# EAGLE design zeta2rework_lw_v23_fixes (EAGLE 9.0.1)
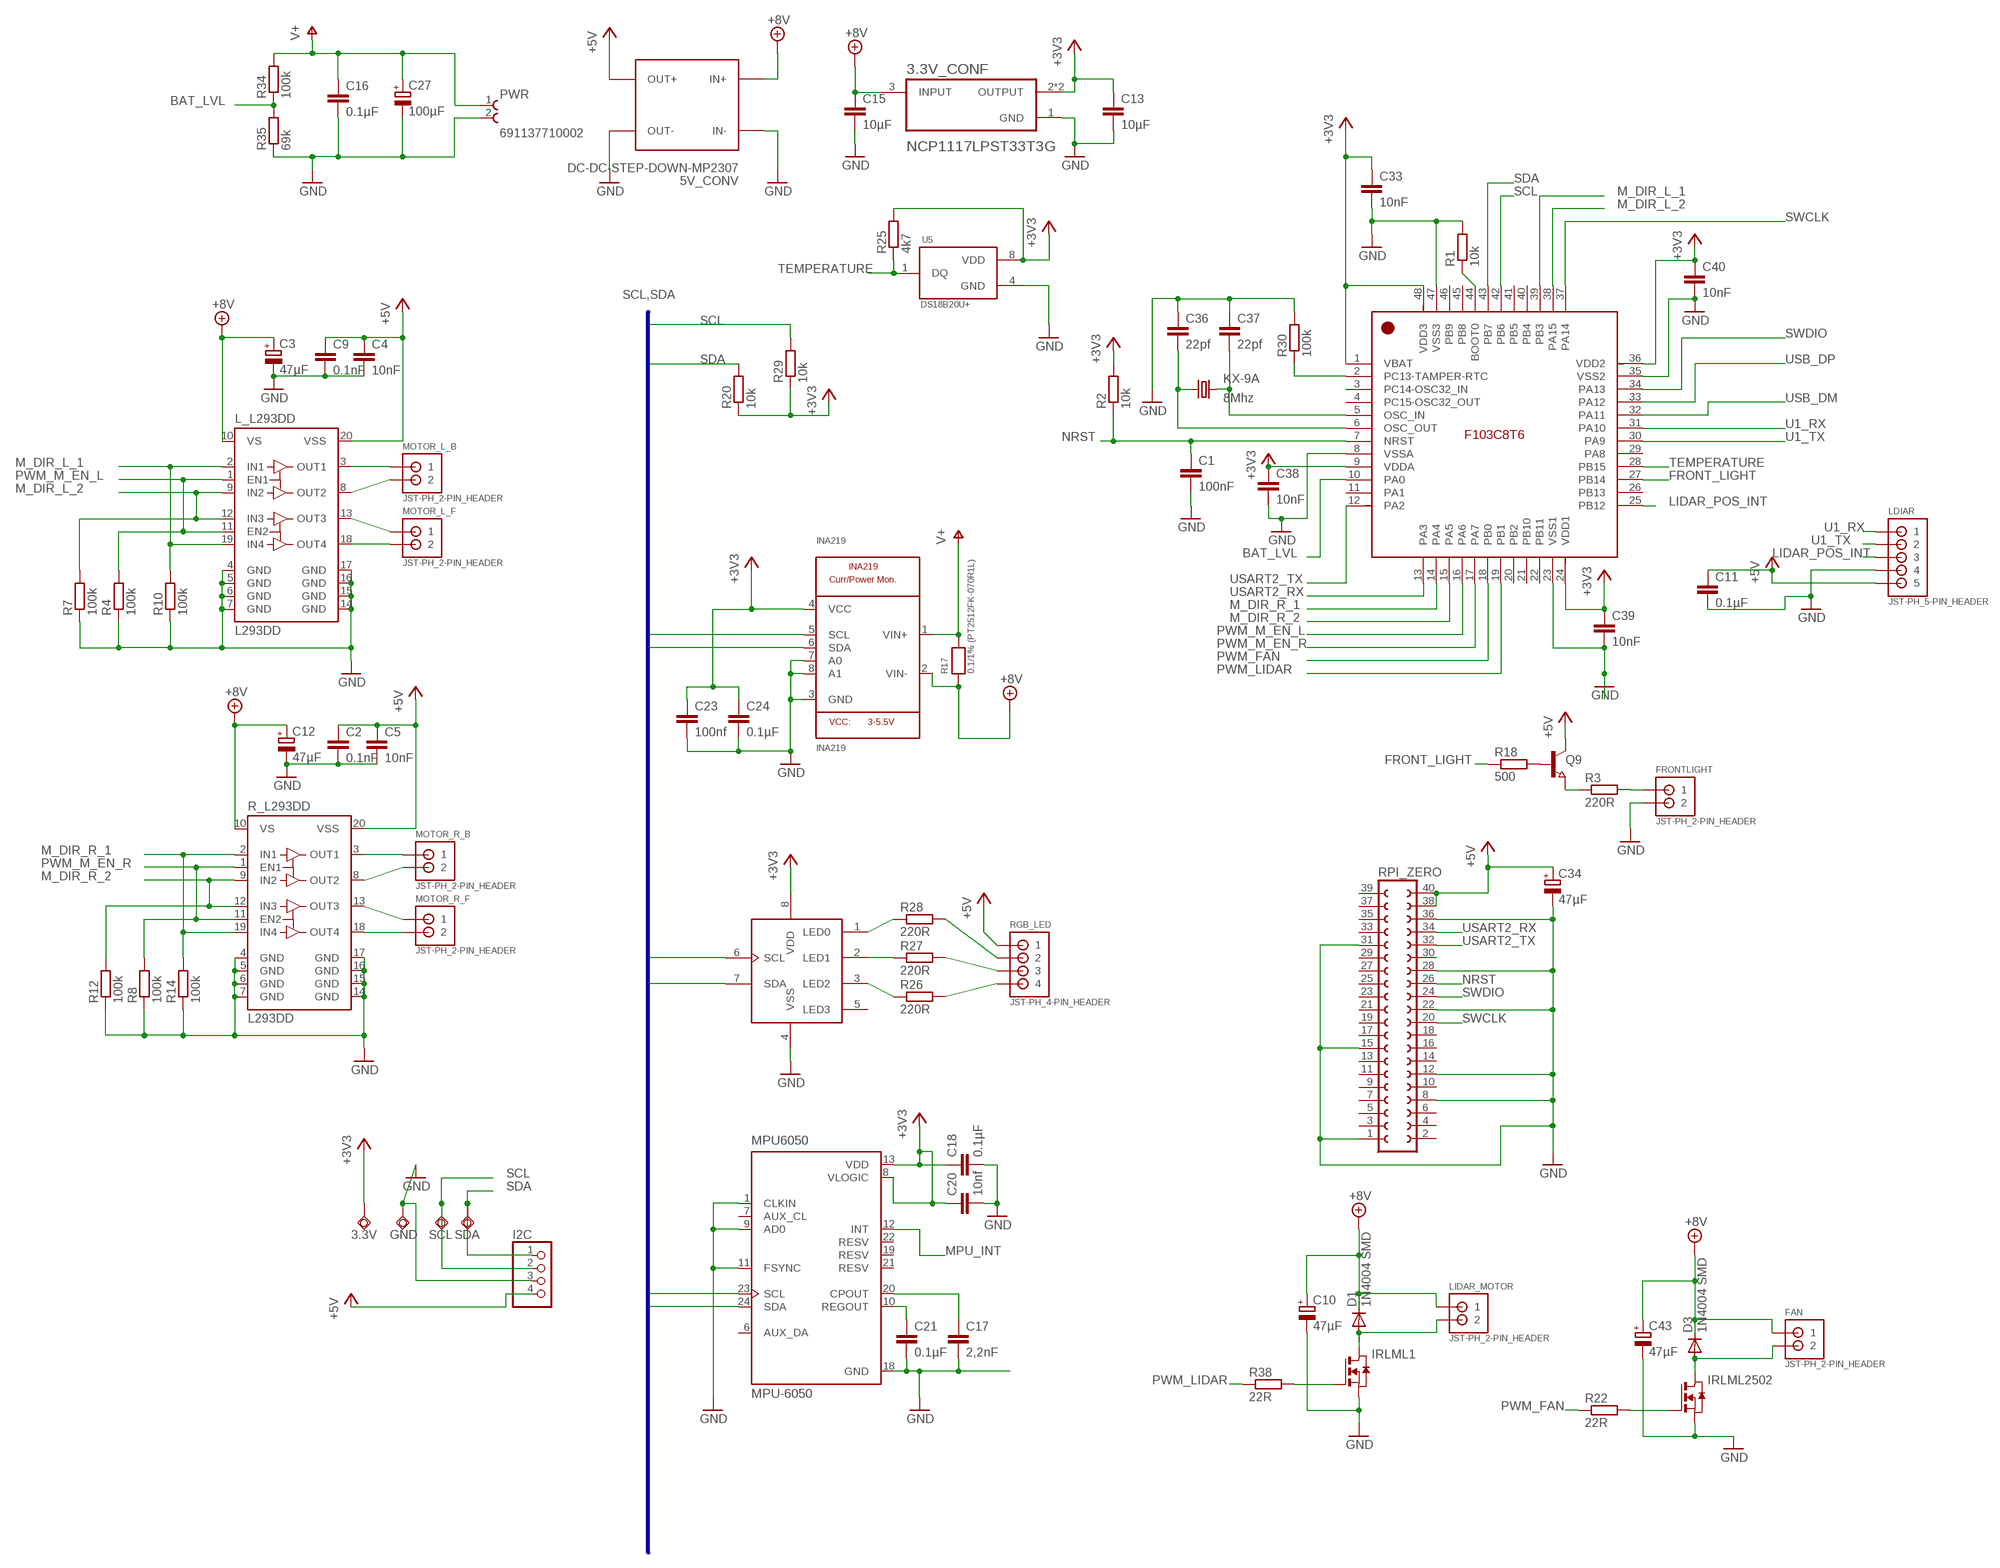
[diagram p0: schematic, sheet 1]

## Parts
3.3V  TPSQTP20R  [TP20R]
3.3V_CONF  NCP1117LPST33T3G  [SOT230P700X175-4N]
5V_CONV  DC-DC-STEP-DOWN-MP2307  [DC-DC-STEP-DOWN-MP2307]
C1  100nF  C-EUC1206  [C1206]
C2  0.1nF  C-EUC1206  [C1206]
C3  47µF  CPOL-EUUD-4X5,8  [UD-4X5,8_NICHICON]
C4  10nF  C-EUC1206  [C1206]
C5  10nF  C-EUC1206  [C1206]
C9  0.1nF  C-EUC1206  [C1206]
C10  47µF  CPOL-EUUD-4X5,8  [UD-4X5,8_NICHICON]
C11  0.1µF  C-EUC1206  [C1206]
C12  47µF  CPOL-EUUD-4X5,8  [UD-4X5,8_NICHICON]
C13  10µF  C-EUC1206  [C1206]
C15  10µF  C-EUC1206  [C1206]
C16  0.1µF  C-EUC1206  [C1206]
C17  2,2nF  C-EUC1206  [C1206]
C18  0.1µF  C-EUC1206  [C1206]
C20  10nf  C-EUC1206  [C1206]
C21  0.1µF  C-EUC1206  [C1206]
C23  100nf  C-EUC1206  [C1206]
C24  0.1µF  C-EUC1206  [C1206]
C27  100µF  CPOL-EUUD-4X5,8  [UD-4X5,8_NICHICON]
C33  10nF  C-EUC1206  [C1206]
C34  47µF  CPOL-EUUD-4X5,8  [UD-4X5,8_NICHICON]
C36  22pf  C-EUC1206  [C1206]
C37  22pf  C-EUC1206  [C1206]
C38  10nF  C-EUC1206  [C1206]
C39  10nF  C-EUC1206  [C1206]
C40  10nF  C-EUC1206  [C1206]
C43  47µF  CPOL-EUUD-4X5,8  [UD-4X5,8_NICHICON]
D1  1N4004 SMD  DIODE-DO214AC  [DO214AC]
D3  1N4004 SMD  DIODE-DO214AC  [DO214AC]
FAN  JST-PH_2-PIN_HEADER  [JST_B2B-PH_HEADER]
FRONTLIGHT  JST-PH_2-PIN_HEADER  [JST_B2B-PH_HEADER]
GND  TPSQTP20R  [TP20R]
I2C  PINHD-1X4  [1X04]
INA219  INA219  [SOT23-8]
IRLML1  NMOSSOT23  [SOT-23]
IRLML2502  NMOSSOT23  [SOT-23]
KX-9A  8Mhz  KX-9A  [5.0X3.2_KX-9A]
L_L293DD  L293DD  [SO20]
LDIAR  JST-PH_5-PIN_HEADER  [JST_B5B-PH_HEADER]
LIDAR_MOTOR  JST-PH_2-PIN_HEADER  [JST_B2B-PH_HEADER]
MOTOR_L_B  JST-PH_2-PIN_HEADER  [JST_B2B-PH_HEADER]
MOTOR_L_F  JST-PH_2-PIN_HEADER  [JST_B2B-PH_HEADER]
MOTOR_R_B  JST-PH_2-PIN_HEADER  [JST_B2B-PH_HEADER]
MOTOR_R_F  JST-PH_2-PIN_HEADER  [JST_B2B-PH_HEADER]
MPU6050  MPU-6050  [QFN50P400X400X95-24N]
PCA9533  PCA9533  [SOIC8]
PWR  691137710002  [691137710002]
Q9  NPN-TRANSISTOR_SOT23  [SOT23]
R1  10k  R-EU_R0603  [R0603]
R2  10k  R-EU_R0603  [R0603]
R3  220R  R-EU_R0603  [R0603]
R4  100k  R-EU_R0603  [R0603]
R7  100k  R-EU_R0603  [R0603]
R8  100k  R-EU_R0603  [R0603]
R10  100k  R-EU_R0603  [R0603]
R12  100k  R-EU_R0603  [R0603]
R14  100k  R-EU_R0603  [R0603]
R17  0.1/1% (PT2512FK-070R1L)  RESISTOR2512  [2512]
R18  500  R-EU_R0603  [R0603]
R20  10k  R-EU_R0603  [R0603]
R22  22R  R-EU_R0603  [R0603]
R25  4k7  R-EU_R0603  [R0603]
R26  220R  R-EU_R0603  [R0603]
R27  220R  R-EU_R0603  [R0603]
R28  220R  R-EU_R0603  [R0603]
R29  10k  R-EU_R0603  [R0603]
R30  100k  R-EU_R0603  [R0603]
R34  100k  R-EU_R0603  [R0603]
R35  69k  R-EU_R0603  [R0603]
R38  22R  R-EU_R0603  [R0603]
R_L293DD  L293DD  [SO20]
RGB_LED  JST-PH_4-PIN_HEADER  [JST_B4B-PH_HEADER]
RPI_ZERO  FE20-2  [FE20-2]
SCL  TPSQTP20R  [TP20R]
SDA  TPSQTP20R  [TP20R]
STM32F103CB  STM32F103CB  STM32F103C8T6  [LQFP48_7X7MM_0.5MMPP]
U5  DS18B20U+  [SOP65P490X95-8N]

## Nets
+3V3: 3.3V.TP 3.3V_CONF.2(OUTPUT) 3.3V_CONF.4(OUTPUT) C13.1 C18.1 C20.1 C23.1 C24.1 C33.1 C38.1 C39.1 C40.1 INA219.4(VCC) MPU6050.8(VLOGIC) MPU6050.13(VDD) PCA9533.8(VDD) R2.2 R20.1 R25.2 R29.1 STM32F103CB.1(VBAT) STM32F103CB.9(VDDA) STM32F103CB.24(VDD1) STM32F103CB.36(VDD2) STM32F103CB.48(VDD3) U5.8(VDD)
+5V: 5V_CONV.OUT+ C2.1 C4.1 C5.1 C9.1 C11.1 C34.+ I2C.4 L_L293DD.20(VSS) LDIAR.P5 Q9.3(C) R_L293DD.20(VSS) RGB_LED.P1 RPI_ZERO.38 RPI_ZERO.40
+8V: 3.3V_CONF.3(INPUT) 5V_CONV.IN+ C3.+ C10.+ C12.+ C15.1 C43.+ D1.C D3.C FAN.P1 INA219.2(VIN-) L_L293DD.10(VS) LIDAR_MOTOR.P1 R17.1 R_L293DD.10(VS)
BAT_LVL: R34.1 R35.2 STM32F103CB.10(PA0)
FRONT_LIGHT: R18.1 STM32F103CB.27(PB14)
GND: 3.3V_CONF.1(GND) 5V_CONV.IN- 5V_CONV.OUT- C1.2 C2.2 C3.- C4.2 C5.2 C9.2 C10.- C11.2 C12.- C13.2 C15.2 C16.2 C17.2 C18.2 C20.2 C21.2 C23.2 C24.2 C27.- C33.2 C34.- C36.1 C37.1 C38.2 C39.2 C40.2 C43.- FRONTLIGHT.P2 GND.TP I2C.3 INA219.3(GND) INA219.7(A0) INA219.8(A1) IRLML1.2(S) IRLML2502.2(S) L_L293DD.4(GND) L_L293DD.5(GND) L_L293DD.6(GND) L_L293DD.7(GND) L_L293DD.14(GND) L_L293DD.15(GND) L_L293DD.16(GND) L_L293DD.17(GND) LDIAR.P4 MPU6050.1(CLKIN) MPU6050.9(AD0) MPU6050.11(FSYNC) MPU6050.18(GND) PCA9533.4(VSS) PWR.2 R1.2 R4.1 R7.1 R8.1 R10.1 R12.1 R14.1 R30.2 R35.1 R_L293DD.4(GND) R_L293DD.5(GND) R_L293DD.6(GND) R_L293DD.7(GND) R_L293DD.14(GND) R_L293DD.15(GND) R_L293DD.16(GND) R_L293DD.17(GND) RPI_ZERO.1 RPI_ZERO.8 RPI_ZERO.12 RPI_ZERO.15 RPI_ZERO.22 RPI_ZERO.28 RPI_ZERO.31 RPI_ZERO.36 STM32F103CB.8(VSSA) STM32F103CB.23(VSS1) STM32F103CB.35(VSS2) STM32F103CB.47(VSS3) U5.4(GND)
LIDAR_POS_INT: LDIAR.P3 STM32F103CB.25(PB12)
M_DIR_L_1: L_L293DD.2(IN1) L_L293DD.19(IN4) R10.2 STM32F103CB.39(PB3)
M_DIR_L_2: L_L293DD.9(IN2) L_L293DD.12(IN3) R7.2 STM32F103CB.38(PA15)
M_DIR_R_1: R14.2 R_L293DD.2(IN1) R_L293DD.19(IN4) STM32F103CB.14(PA4)
M_DIR_R_2: R12.2 R_L293DD.9(IN2) R_L293DD.12(IN3) STM32F103CB.15(PA5)
MPU_INT: MPU6050.12(INT)
N$1: MOTOR_R_B.P2 R_L293DD.8(OUT2)
N$2: MOTOR_R_F.P2 R_L293DD.18(OUT4)
N$3: MOTOR_R_F.P1 R_L293DD.13(OUT3)
N$4: L_L293DD.18(OUT4) MOTOR_L_F.P2
N$5: R1.1 STM32F103CB.44(BOOT0)
N$16: L_L293DD.13(OUT3) MOTOR_L_F.P1
N$17: L_L293DD.8(OUT2) MOTOR_L_B.P2
N$18: L_L293DD.3(OUT1) MOTOR_L_B.P1
N$19: Q9.1(B) R18.2
N$20: Q9.2(E) R3.1
N$21: FRONTLIGHT.P1 R3.2
N$22: PCA9533.3(LED2) R26.1
N$23: PCA9533.2(LED1) R27.1
N$24: PCA9533.1(LED0) R28.1
N$26: MOTOR_R_B.P1 R_L293DD.3(OUT1)
N$31: R26.2 RGB_LED.P4
N$33: R27.2 RGB_LED.P3
N$34: C17.1 MPU6050.20(CPOUT)
N$35: R28.2 RGB_LED.P2
N$36: C21.1 MPU6050.10(REGOUT)
N$37: IRLML2502.3(G) R22.2
N$38: IRLML1.3(G) R38.2
N$39: D1.A IRLML1.1(D) LIDAR_MOTOR.P2
N$46: C36.2 KX-9A.1 STM32F103CB.6(OSC_OUT)
N$47: C37.2 KX-9A.3 STM32F103CB.5(OSC_IN)
N$49: R30.1 STM32F103CB.2(PC13-TAMPER-RTC)
N$55: D3.A FAN.P2 IRLML2502.1(D)
NRST: C1.1 R2.1 RPI_ZERO.26 STM32F103CB.7(NRST)
PWM_FAN: R22.1 STM32F103CB.18(PB0)
PWM_LIDAR: R38.1 STM32F103CB.19(PB1)
PWM_M_EN_L: L_L293DD.1(EN1) L_L293DD.11(EN2) R4.2 STM32F103CB.16(PA6)
PWM_M_EN_R: R8.2 R_L293DD.1(EN1) R_L293DD.11(EN2) STM32F103CB.17(PA7)
SCL: I2C.2 INA219.5(SCL) MPU6050.23(SCL) PCA9533.6(SCL) R29.2 SCL.TP STM32F103CB.42(PB6)
SDA: I2C.1 INA219.6(SDA) MPU6050.24(SDA) PCA9533.7(SDA) R20.2 SDA.TP STM32F103CB.43(PB7)
SWCLK: RPI_ZERO.20 STM32F103CB.37(PA14)
SWDIO: RPI_ZERO.24 STM32F103CB.34(PA13)
TEMPERATURE: R25.1 STM32F103CB.28(PB15) U5.1(DQ)
U1_RX: LDIAR.P1 STM32F103CB.31(PA10)
U1_TX: LDIAR.P2 STM32F103CB.30(PA9)
USART2_RX: RPI_ZERO.34 STM32F103CB.13(PA3)
USART2_TX: RPI_ZERO.32 STM32F103CB.12(PA2)
USB_DM: STM32F103CB.32(PA11)
USB_DP: STM32F103CB.33(PA12)
V+: C16.1 C27.+ INA219.1(VIN+) PWR.1 R17.2 R34.2
Unconnected: MPU6050.6(AUX_DA) MPU6050.7(AUX_CL) MPU6050.19(RESV) MPU6050.21(RESV) MPU6050.22(RESV) PCA9533.5(LED3) RPI_ZERO.2 RPI_ZERO.3 RPI_ZERO.4 RPI_ZERO.5 RPI_ZERO.6 RPI_ZERO.7 RPI_ZERO.9 RPI_ZERO.10 RPI_ZERO.11 RPI_ZERO.13 RPI_ZERO.14 RPI_ZERO.16 RPI_ZERO.17 RPI_ZERO.18 RPI_ZERO.19 RPI_ZERO.21 RPI_ZERO.23 RPI_ZERO.25 RPI_ZERO.27 RPI_ZERO.29 RPI_ZERO.30 RPI_ZERO.33 RPI_ZERO.35 RPI_ZERO.37 RPI_ZERO.39 STM32F103CB.3(PC14-OSC32_IN) STM32F103CB.4(PC15-OSC32_OUT) STM32F103CB.11(PA1) STM32F103CB.20(PB2) STM32F103CB.21(PB10) STM32F103CB.22(PB11) STM32F103CB.26(PB13) STM32F103CB.29(PA8) STM32F103CB.40(PB4) STM32F103CB.41(PB5) STM32F103CB.45(PB8) STM32F103CB.46(PB9)

## Buses
SCL,SDA

## Library data of the parts
3.3V GND SCL SDA = testpad:TPSQ: Test pad
3.3V_CONF = NCP1117LPST33T3G:NCP1117LPST33T3G: None; AVAILABILITY: Unavailable; DESCRIPTION: Linear Voltage Regulator, Positive, LDO, 1.0 A _Fixed and Adjustable_ Vout: 3.3 V; MF: ON Semiconductor; MP: NCP1117LPST33T3G; PACKAGE: SOT-223 ON Semiconductor; PRICE: None
5V_CONV = diy-modules:DC-DC-STEP-DOWN-MP2307: DC/DC Step-Down Regulator based on MP2307DN chip MP2307 datasheet available here: https://cdn-shop.adafruit.com/datasheets/MP2307_r1.9.pdf Click here to find device on ebay.com <http://www.ebay.com/sch/dc+dc+3a+mini+converter>
C1 C2 C4 C5 C9 C11 C13 C15-C18 C20 C21 C23 C24 C33 C36-C40 = rcl:C-EU: CAPACITOR, European symbol; SPICEPREFIX: C
C3 C10 C12 C27 C34 C43 = rcl:CPOL-EU: POLARIZED CAPACITOR, European symbol; SPICEPREFIX: C
D1 D3 = diode:DIODE-: DIODE
FAN FRONTLIGHT LIDAR_MOTOR MOTOR_L_B MOTOR_L_F MOTOR_R_B MOTOR_R_F = srg:JST-PH_2-PIN_HEADER: 2-pin JST PH Shrouded Header, top entry P/N B2B-PH-K-S Mating connector PHR-2 Mating cable assembly: Sparkfun PRT-09914 <http://www.sparkfun.com/products/9914>
I2C = pinhead:PINHD-1X4: PIN HEADER
INA219 = INA219:INA219: INA219 - I2C Current/Power Monitor Voltage Range: 0-26V Accuracy: 0.5% Temperature: -40°C - 125°C; AVAILABILITY: Unavailable; DESCRIPTION: the ina219 is a high-side current shunt and power monitor with an i2c interface. the ina219 monitors both shunt drop ...; MF: Texas Instruments; MP: INA219; PACKAGE: None; PRICE: None
IRLML1 IRLML2502 = zetex:NMOSSOT23: MOS FET; OC_FARNELL: unknown; OC_NEWARK: unknown
KX-9A = crystal-geyer_V1_0:KX: Quartz Crystals (MHz) SMD: KX - Serie Model Size l/w/h [mm] Frequency Range Frequency Stability Temp. Range [°C] Load Capacitance AECQ 200 availabel Datasheet KX-4 KX-5 KX-6 KX-7 KX-9A KX-9B KX-12A KX-12B KX-13 KX-20 KX-K KX-KS 1.6/1.2/0.3 2.0/1.6/0.45 2.5/2.0/0.55 3.2/2.5/0.8 5.0/3.2/1.0 5.0/3.2/1.1 6.0/3.5/1.1 6.0/3.5/1.0 7.0/5.0 /1.3 11.6/5.5/1.6 12.3/4.5/4.2 12.3/4.5/3.2 24.0 ~ 80.0 MHz 16.0 ~ 80.0 MHz 12.0 ~ 80.0 MHz 8.0 ~ 60.0 MHz 7,68 ~ 300,0 MHz 8,0 ~ 50,0 MHz 8,0 ~ 150,0 MHz 8,0 ~ 50,0 MHz 6,0 ~ 160,0 MHz 3,579 ~ 25,0 MHz 3,579 ~ 70,0 MHz 3,579 ~ 70,0 MHz ±10 … ±50ppm ±10 … ±50ppm ±10 … ±50ppm ±10 … ±50ppm ±10 … ±50ppm ±10 … ±50ppm ±10 … ±50ppm ±10 … ±50ppm ±10 … ±50ppm ±50ppm ±10 … ±50ppm ±10 … ±50ppm (*) -40°C …+85°C (*) -40°C …+125°C (*) -40°C …+125°C (*) -40°C …+125°C (*) -40°C …+105°C (*) -40°C …+105°C (*) -40°C …+125°C (*) -40°C …+105°C (*) -40°C …+105°C (*) -40°C …+105°C (*) -40°C …+85°C (*) -40°C …+85°C 8, 8…16 8, 8…16 10, 8…16 12, 7…20 16, 10…20 16, 10…20 16, 10…20 16, 12…20 16, 12…20 16, 12…20 16, 12…30 16, 12…30 - yes yes yes - - - - - - - - KX-4.pdf <http://www.geyer-electronic.de/uploads/tx_userartikelfrequenz/GEYER-KX-4.pdf> KX-5.pdf <http://www.geyer-electronic.de/uploads/tx_userartikelfrequenz/GEYER-KX-5.pdf> KX-6.pdf <http://www.geyer-electronic.de/uploads/tx_userartikelfrequenz/GEYER-KX-6.pdf> KX-7.pdf <http://www.geyer-electronic.de/uploads/tx_userartikelfrequenz/GEYER-KX-7.pdf> KX-9A.pdf <http://www.geyer-electronic.de/uploads/tx_userartikelfrequenz/GEYER-KX-9A.pdf> KX-9B.pdf <http://www.geyer-electronic.de/uploads/tx_userartikelfrequenz/GEYER-KX-9B.pdf> KX-12A.pdf <http://www.geyer-electronic.de/uploads/tx_userartikelfrequenz/GEYER-KX-12A.pdf> KX-12B.pdf <http://www.geyer-electronic.de/uploads/tx_userartikelfrequenz/GEYER-KX-12B.pdf> KX-13.pdf <http://www.geyer-electronic.de/uploads/tx_userartikelfrequenz/GEYER-KX-13.pdf> KX-20.pdf <http://www.geyer-electronic.de/uploads/tx_userartikelfrequenz/GEYER-KX-20.pdf> KX-K.pdf <http://www.geyer-electronic.de/uploads/tx_userartikelfrequenz/GEYER-KX-K.pdf> KX-KS.pdf <http://www.geyer-electronic.de/uploads/tx_userartikelfrequenz/GEYER-KX-KS.pdf> <http://www.geyer-electronic.de/fileadmin/template/img/logo-geyer-electronic.png> Details see: http://www.geyer-electronic.de/Frequenz-Produkte.9.0.html Created 2016-06-07, Hans Locher 2016 (C) Geyer Quartz Technology KX4,KX5,KX6,KX7,KX9A,KX9B,KX12A,KX12B,KX13,KX20,KXK,KXKS;1612;2016;2520;3225;5032;6035;7050;11655;12345;1,6x1,2;2,0x1,6;2,5x2,0;3,2x2,5;5,0x3,2;6,0x3,5;7,0x5,0;11,6x5,5;12,3x4,5;12,3x4,5;1.6x1.2;2.0x1.6;2.5x2.0;3.2x2.5;5.0x3.2;6.0x3.5;7.0x5.0;11.6x5.5;12.3x4.5;12.3x4.5;
L_L293DD R_L293DD = st-microelectronics:L293DD: PUSH-PULL FOUR CHANNEL DRIVER WITH DIODES Source: http://www.st.com/stonline/books/pdf/docs/1330.pdf; OC_FARNELL: unknown
LDIAR = srg:JST-PH_5-PIN_HEADER: 5-pin JST PH Shrouded Header, top entry P/N B5B-PH-K-S Mating connector PHR-5 Mating cable assembly: Sparkfun PRT-09917 <http://www.sparkfun.com/products/9917>
MPU6050 = MPU-6050:MPU-6050: MPU-6050 Six-Axis (Gyro + Accelerometer) MEMS MotionTracking™ Devices; AVAILABILITY: Good; DESCRIPTION: 3-axis gyroscope, 3-axis accelerometer in a 4x4x0.9 housing; MF: TDK; MP: MPU-6050; PACKAGE: QFN-24 InvenSense; PRICE: 5.12 USD
PCA9533 = adam - ics:PCA9533: PCA9533D/01: LED driver and dimmer 4 channel, PWM @ 8 bit resolution 25mA / channel sink external resistors per LED I2C protocol @ 400kHz (fast) digikey: 568-3372-5-ND, 8-SOIC, $1.92
PWR = term block:691137710002: SERIE 1377 - 5.00 MM - HORIZONTAL CABLE ENTRY WITH PRESSURE CLAMP - GLOW WIRE PLASTIC - WR-TBL <http://katalog.we-online.de/media/images/v2/Family_WR-TBL1_6911377100xx.jpg> Details see: http://katalog.we-online.de/en/em/TBL_5_00_1377_HORIZONTAL_ENTRY_W_PRESSURE_CLAMP_GLOW_WIRE_6911377100xx Created by Yingchun,Shan 2016(C) Wurth Elektronik; AVAILABILITY: Unavailable; DESCRIPTION: Term Block 2pos Side Entry 5mm; MF: Wurth Electronics; MP: 691137710002; PACKAGE: None; PRICE: None
Q9 = semicon-smd-ipc:NPN-TRANSISTOR_: NPN TRANSISTOR
R1-R4 R7 R8 R10 R12 R14 R18 R20 R22 R25-R30 R34 R35 R38 = rcl:R-EU_: RESISTOR, European symbol; SPICEPREFIX: R
R17 = microbuilder:RESISTOR: Resistors 0402 - 0402 Surface Mount Package 22 Ohm 1% 1/16W [Digikey: 311-22.0LRTR-ND] 33 Ohm 5% 1/16W 1.0K 5% 1/16W 1.5K 5% 1/16W 2.0K 1% 1/16W 10.0K 1% 1/16W [Digikey: 311-10.0KLRTR-ND] 10.0K 5% 1/16W [Digikey: RMCF0402JT10K0TR-ND] 12.1K 1% 1/16W [Digikey: 311-22.0LRTR-ND] 100.0K 5% 1/16W 0603 - 0603 Surface Mount Package 0 Ohm 1/10 Watt 1% Resistor 15 Ohm 1/10 Watt 1% Resistor 33 Ohm 1/10 Watt 1% Resistor 49.9 Ohm 1/10 Watt 1% Resistor 100 Ohm 1/10 Watt 1% Resistor 150 Ohm 1/10 Watt 1% Resistor 240 Ohm 1/10 Watt 1% Resistor 390 Ohm 1/10 Watt 1% Resistor 560 Ohm 1/10 Watt 1% Resistor 680 Ohm 1/10 Watt 1% Resistor 750 Ohm 1/10 Watt 1% Resistor 1.0K Ohm 1/10 Watt 1% Resistor 1.5K Ohm 1/10 Watt 1% Resistor 2.0K Ohm 1/10 Watt 1% Resistor 2.2K Ohm 1/10 Watt 1% Resistor 3.3K Ohm 1/10 Watt 1% Resistor 4.7K Ohm 1/10 Watt 1% Resistor 10.0K Ohm 1/10 Watt 1% Resistor 12.0K Ohm 1/10 Watt 1% Resistor 12.1K Ohm 1/10 Watt 1% Resistor 20.0K Ohm 1/10 Watt 1% Resistor 33.0K Ohm 1/10 Watt 1% Resistor 100.0K Ohm 1/10 Watt 1% Resistor 0805 - 0805 Surface Mount Package 0 Ohm 1/8 Watt 1% Resistor 33 Ohm 1/8 Watt 1% Resistor 100 Ohm 1/8 Watt 1% Resistor 150 Ohm 1/8 Watt 1% Resistor 200 Ohm 1/8 Watt 1% Resistor 240 Ohm 1/8 Watt 1% Resistor 330 Ohm 1/8 Watt 1% Resistor 390 Ohm 1/8 Watt 1% Resistor 470 Ohm 1/8 Watt 1% Resistor 1.0K Ohm 1/8 Watt 1% Resistor 1.5K Ohm 1/8 Watt 1% Resistor 2.0K Ohm 1/8 Watt 1% Resistor 4.7K Ohm 1/8 Watt 1% Resistor 5.1K Ohm 1/8 Watt 1% Resistor 5.6K Ohm 1/8 Watt 1% Resistor 10.0K Ohm 1/8 Watt 1% Resistor 22.0K Ohm 1/8 Watt 1% Resistor 33.0K Ohm 1/8 Watt 1% Resistor 100K Ohm 1/8 Watt 1% Resistor 1206 - 1206 Surface Mount Package 2012 - 2010 Surface Mount Package 0.11 Ohm 1/2 Watt 1% Resistor - Digikey: RHM.11UCT-ND
RGB_LED = srg:JST-PH_4-PIN_HEADER: 4-pin JST PH Shrouded Header, top entry P/N B4B-PH-K-S Mating connector PHR-4 Mating cable assembly: Sparkfun PRT-09916 <http://www.sparkfun.com/products/9916>
RPI_ZERO = con-lsta:FE20-2: FEMALE HEADER; OC_FARNELL: unknown; OC_NEWARK: unknown
STM32F103CB = STM32F103C8T6:STM32F103C8T6; AVAILABILITY: Good; DESCRIPTION: Mainstream Performance line, ARM Cortex-M3 MCU with 64 Kbytes Flash, 72 MHz CPU, motor control, USB and CAN; MF: STMicroelectronics; MP: STM32F103C8T6; PACKAGE: LQFP-48 STMicroelectronics; PRICE: 3.83 USD
U5 = DS18B20U_:DS18B20U+: Board Mount Temperature Sensors Prgmble Resolution 1-Wire Parasite Pwr; AVAILABILITY: Unavailable; DESCRIPTION: Date Code: 1043+; RoHS Compliant: Yes;; MF: Maxim; MP: DS18B20U+; PACKAGE: TSSOP-8 Chip Coolers; PRICE: None

## Board
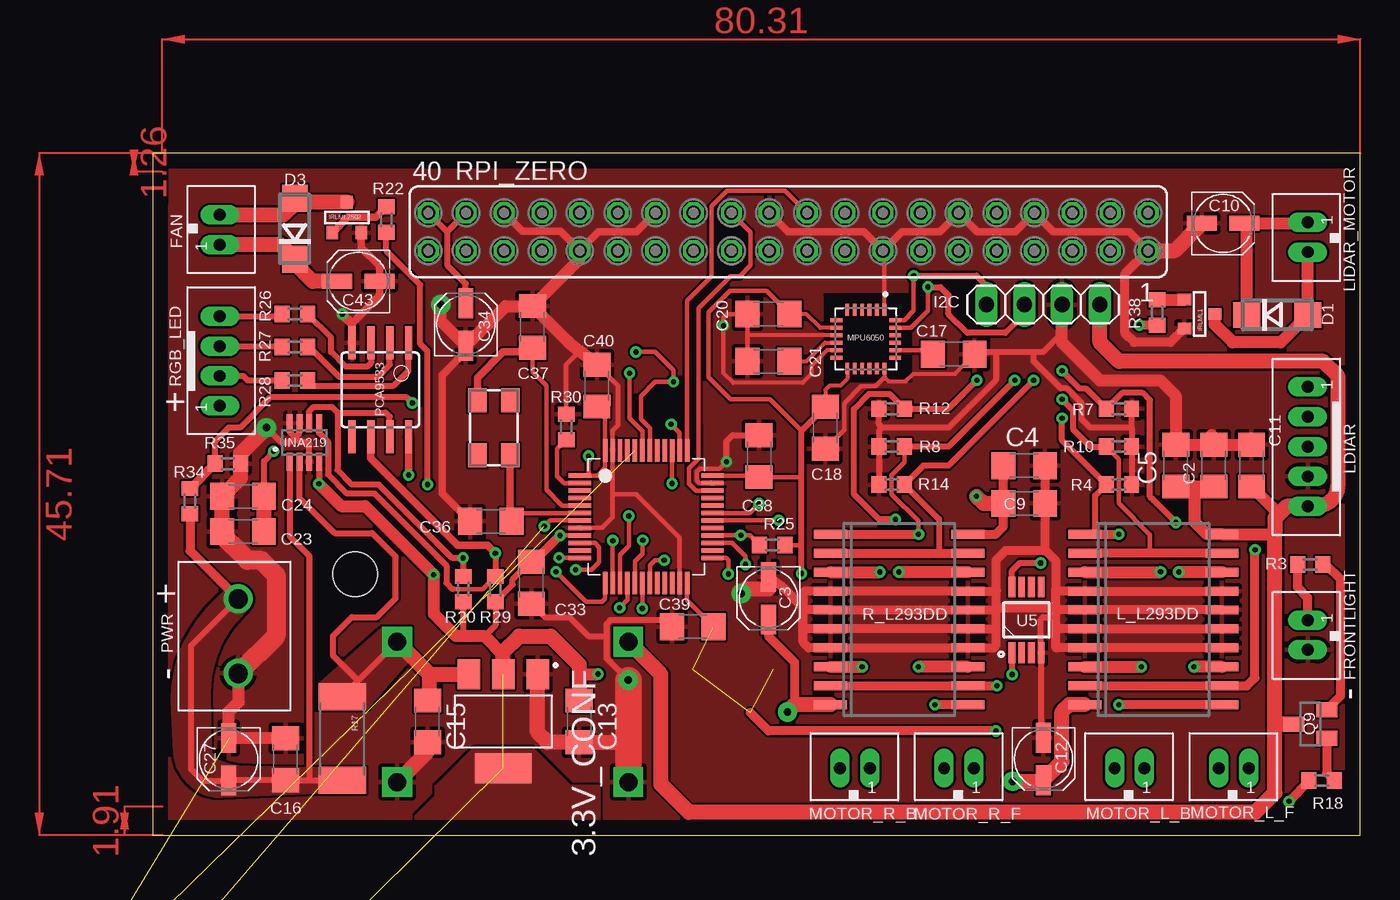
[diagram p1: board, top side]
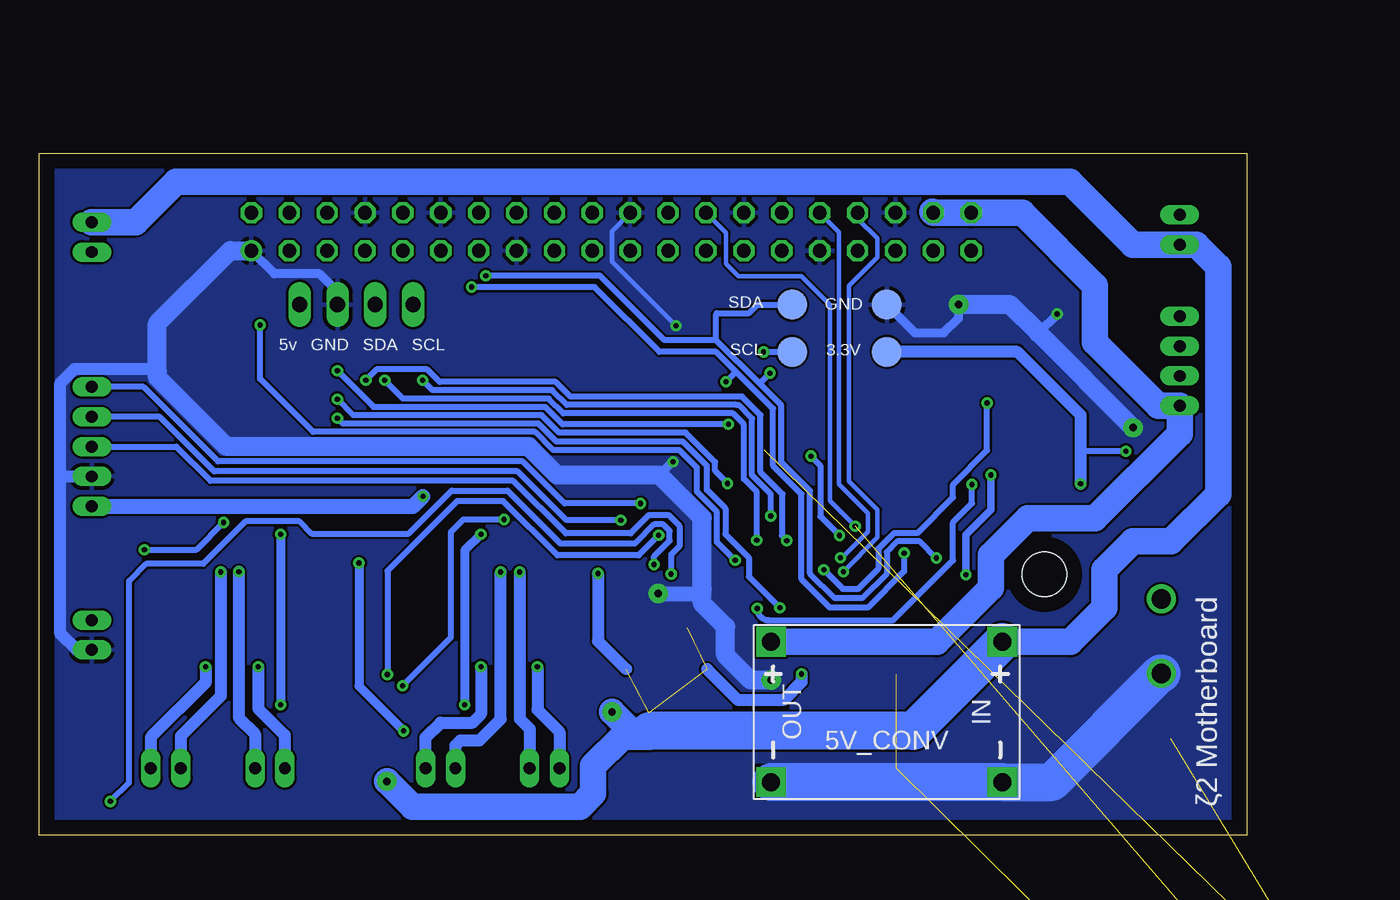
[diagram p2: board, bottom side, seen from below]

Size 80.95 x 45.71 mm. Coordinates in mm from the lower left corner, seen from the top.
Outline: 0,0 80.95,0 80.95,45.71 0,45.71 0,0
Copper layers (1*16): Top 0.035mm / dielectric 1.5mm / Bottom 0.035mm
Design rules "default": minimum track width 6mil, minimum drill 0.35mm, track to track 6mil, track to pad 6mil, pad to pad 6mil, via to via 6mil, smd to smd 6mil, copper to edge 40mil, drill to drill 6mil, minimum pad ring 10mil, minimum via ring 8mil, stop-mask expansion 4mil, vias tented up to drill 0mil, thermal gap 10mil
Holes 3 mm at 13.56,17.48

### Footprints (pad centres in the part's own frame; a part is rotated, then mirrored left to right if it is on the bottom)
TP20R = smd 2 x 2: TP 0,0
SOT230P700X175-4N = smd 2 x 1.5: 1 -3.15,2.3; 2 -3.15,0; 3 -3.15,-2.3 | smd 2 x 3.8: 4 3.15,0
DC-DC-STEP-DOWN-MP2307 = drill 1.2 pad 2 square: IN+ -7.747,-4.699; IN- -7.747,4.699; OUT+ 7.747,-4.699; OUT- 7.747,4.699
C1206 = smd 1.6 x 1.8: 1 -1.4,0; 2 1.4,0
UD-4X5,8_NICHICON = smd 2 x 1: + 1.425,0; - -1.425,0
DO214AC = smd 1.8 x 1.7: A 2.05,0; C -2.05,0
JST_B2B-PH_HEADER = drill 0.8 long: P1 1.075,0.048; P2 -0.925,0.048
1X04 = drill 1.016 long: 1 -3.81,0; 2 -1.27,0; 3 1.27,0; 4 3.81,0
SOT23-8 = smd 0.4 x 1.2: 1 -0.975,-1.3; 2 -0.325,-1.3; 3 0.325,-1.3; 4 0.975,-1.3; 5 0.975,1.3; 6 0.325,1.3; 7 -0.325,1.3; 8 -0.975,1.3
SOT-23 = smd 0.787 x 0.889: 1 0.025,-1.016; 2 -0.94,1.016; 3 0.991,1.016
5.0X3.2_KX-9A = smd 1.6 x 1.25: 1 -1.85,-1.1; 2 1.85,-1.1; 3 1.85,1.1; 4 -1.85,1.1
SO20 = smd 0.6 x 2.2: 1 -5.715,-4.6; 2 -4.445,-4.6; 3 -3.175,-4.6; 4 -1.905,-4.6; 5 -0.635,-4.6; 6 0.635,-4.6; 7 1.905,-4.6; 8 3.175,-4.6; 9 4.445,-4.6; 10 5.715,-4.6; 11 5.715,4.6; 12 4.445,4.6; 13 3.175,4.6; 14 1.905,4.6; 15 0.635,4.6; 16 -0.635,4.6; 17 -1.905,4.6; 18 -3.175,4.6; 19 -4.445,4.6; 20 -5.715,4.6
JST_B5B-PH_HEADER = drill 0.8 long: P1 4,0.048; P2 2,0.048; P3 0,0.048; P4 -2,0.048; P5 -4,0.048
QFN50P400X400X95-24N = smd 0.79 x 0.26: 1 -1.97,1.25; 2 -1.97,0.75; 3 -1.97,0.25; 4 -1.97,-0.25; 5 -1.97,-0.75; 6 -1.97,-1.25; 13 1.97,-1.25; 14 1.97,-0.75; 15 1.97,-0.25; 16 1.97,0.25; 17 1.97,0.75; 18 1.97,1.25 | smd 0.26 x 0.79: 7 -1.25,-1.97; 8 -0.75,-1.97; 9 -0.25,-1.97; 10 0.25,-1.97; 11 0.75,-1.97; 12 1.25,-1.97; 19 1.25,1.97; 20 0.75,1.97; 21 0.25,1.97; 22 -0.25,1.97; 23 -0.75,1.97; 24 -1.25,1.97
SOIC8 = smd 0.5 x 2.2: 1 -1.905,-3.154; 2 -0.645,-3.154; 3 0.625,-3.154; 4 1.895,-3.154; 5 1.905,3.154; 6 0.635,3.154; 7 -0.635,3.154; 8 -1.905,3.154
691137710002 = drill 1.3: 1 -2.5,0; 2 2.5,0
SOT23 = smd 1 x 1.4: 1 -0.95,-1.1; 2 0.95,-1.1; 3 0,1.1
R0603 = smd 1 x 1.1: 1 -0.85,0; 2 0.85,0
2512 = smd 1.8 x 3.2: 1 -2.8,0; 2 2.8,0
JST_B4B-PH_HEADER = drill 0.8 long: P1 2.98,0.048; P2 0.98,0.048; P3 -1.02,0.048; P4 -3.02,0.048
FE20-2 = drill 0.914: 1 -24.13,1.27 | drill 0.914 octagon: 2 -24.13,-1.27; 3 -21.59,1.27; 4 -21.59,-1.27; 5 -19.05,1.27; 6 -19.05,-1.27; 7 -16.51,1.27; 8 -16.51,-1.27; 9 -13.97,1.27; 10 -13.97,-1.27; 11 -11.43,1.27; 12 -11.43,-1.27; 13 -8.89,1.27; 14 -8.89,-1.27; 15 -6.35,1.27; 16 -6.35,-1.27; 17 -3.81,1.27; 18 -3.81,-1.27; 19 -1.27,1.27; 20 -1.27,-1.27; 21 1.27,1.27; 22 1.27,-1.27; 23 3.81,1.27; 24 3.81,-1.27; 25 6.35,1.27; 26 6.35,-1.27; 27 8.89,1.27; 28 8.89,-1.27; 29 11.43,1.27; 30 11.43,-1.27; 31 13.97,1.27; 32 13.97,-1.27; 33 16.51,1.27; 34 16.51,-1.27; 35 19.05,1.27; 36 19.05,-1.27; 37 21.59,1.27; 38 21.59,-1.27; 39 24.13,1.27; 40 24.13,-1.27
LQFP48_7X7MM_0.5MMPP = smd 1.5 x 0.3: 1 -4.45,2.75; 2 -4.45,2.25; 3 -4.45,1.75; 4 -4.45,1.25; 5 -4.45,0.75; 6 -4.45,0.25; 7 -4.45,-0.25; 8 -4.45,-0.75; 9 -4.45,-1.25; 10 -4.45,-1.75; 11 -4.45,-2.25; 12 -4.45,-2.75; 25 4.45,-2.75; 26 4.45,-2.25; 27 4.45,-1.75; 28 4.45,-1.25; 29 4.45,-0.75; 30 4.45,-0.25; 31 4.45,0.25; 32 4.45,0.75; 33 4.45,1.25; 34 4.45,1.75; 35 4.45,2.25; 36 4.45,2.75 | smd 0.3 x 1.5: 13 -2.75,-4.45; 14 -2.25,-4.45; 15 -1.75,-4.45; 16 -1.25,-4.45; 17 -0.75,-4.45; 18 -0.25,-4.45; 19 0.25,-4.45; 20 0.75,-4.45; 21 1.25,-4.45; 22 1.75,-4.45; 23 2.25,-4.45; 24 2.75,-4.45; 37 2.75,4.45; 38 2.25,4.45; 39 1.75,4.45; 40 1.25,4.45; 41 0.75,4.45; 42 0.25,4.45; 43 -0.25,4.45; 44 -0.75,4.45; 45 -1.25,4.45; 46 -1.75,4.45; 47 -2.25,4.45; 48 -2.75,4.45
SOP65P490X95-8N = smd 1.4 x 0.45: 1 -2.2,0.975; 2 -2.2,0.325; 3 -2.2,-0.325; 4 -2.2,-0.975; 5 2.2,-0.975; 6 2.2,-0.325; 7 2.2,0.325; 8 2.2,0.975

### Placement (x,y rotation side)
3.3V  24.13,32.38 0 bottom
3.3V_CONF  23.5,7.62 270 top
5V_CONV  24.13,8.25 180 bottom
C1  -8.26,-20.96 0 top  (outside the outline)
C2  71.12,24.77 90 top
C3  41.27,15.88 270 top
C4  58.42,24.77 0 top
C5  68.58,24.77 90 top
C9  58.42,22.23 0 top
C10  71.76,41 0 top
C11  73.66,24.77 90 top
C12  59.72,5.11 270 top
C13  28.58,7.62 270 top
C15  18.42,7.62 270 top
C16  8.89,5.08 90 top
C17  53.7,32.23 0 top
C18  45.09,27.3 270 top
C20  41.27,34.92 180 top
C21  41.27,31.75 180 top
C23  6.05,20.35 180 top
C24  6.05,22.71 180 top
C27  5.08,5.08 270 top
C33  25.37,16.92 270 top
C34  20.98,34.21 90 top
C36  22.66,21.03 0 top
C37  25.45,34.06 270 top
C38  40.64,25.4 90 top
C39  36.2,13.97 180 top
C40  29.77,30.12 89.8 top
C43  13.77,37.11 180 top
D1  75.39,34.85 0 top
D3  9.53,40.64 90 top
FAN  4.45,40.64 270 top
FRONTLIGHT  77.47,13.34 90 top
GND  24.13,35.56 0 bottom
I2C  59.69,35.56 0 top
INA219  10.16,26.31 0 top
IRLML1  70.18,34.9 90 top
IRLML2502  13.03,41.4 180 top
KX-9A  22.86,27.3 90 top
L_L293DD  67.08,14.45 270 top
LDIAR  77.47,26.04 90 top
LIDAR_MOTOR  77.47,40.01 90 top
MOTOR_L_B  65.41,4.44 0 top
MOTOR_L_F  72.39,4.44 0 top
MOTOR_R_B  46.99,4.44 0 top
MOTOR_R_F  53.98,4.44 0 top
MPU6050  47.8,33.25 270 top
PCA9533  15.24,29.84 180 top
PWR  5.71,13.34 270 top
Q9  77.6,7.44 90 top
R1  -8.89,-15.24 0 top  (outside the outline)
R2  -8.89,-26.67 0 top  (outside the outline)
R3  77.6,18.14 180 top
R4  64.77,23.5 180 top
R7  64.77,28.58 180 top
R8  49.53,26.04 0 top
R10  64.77,26.04 180 top
R12  49.53,28.58 0 top
R14  49.53,23.5 0 top
R17  12.7,6.48 270 top
R18  78.36,3.66 0 top
R20  20.8,16.48 90 top
R22  15.65,41.25 90 top
R25  41.53,19.43 0 top
R26  9.53,34.92 180 top
R27  9.53,32.72 180 top
R28  9.53,30.48 180 top
R29  22.96,16.48 90 top
R30  27.71,27.36 90 top
R34  2.49,22.38 270 top
R35  5.03,24.89 180 top
R38  67.34,35.03 90 top
R_L293DD  50.04,14.45 270 top
RGB_LED  4.45,31.75 270 top
RPI_ZERO  42.6,40.44 180 top
SCL  30.48,32.38 0 bottom
SDA  30.48,35.56 0 bottom
STM32F103CB  33.07,21.34 0 top
U5  58.57,14.43 90 top

### Tracks (layer width: path | path; a pad name or v marks a point on that pad's centre or on a via)
+3V3  (via drill 0.35)  (5 unrouted)
  Top 0.254: MPU6050.13 46.55,30.58 46.1,30.12 45.36,30.12 45.09,29.84 C18.1 | MPU6050.8 44.74,34 43.81,34.92 C20.1
  Top 0.305: STM32F103CB.1 29.21,24.09 | 29.21,24.09 29.8,24.09 30.32,24.61 STM32F103CB.48 30.32,28.17 C40.1 | STM32F103CB.9 v27.31,20.09 | v29.21,25.4 29.21,24.09 | 37.52,13.89 C39.1 35.82,15.74 STM32F103CB.24 | STM32F103CB.36 40.55,24.09 C38.1 43.46,24 43.48,23.98 | v43.48,17.53 43.48,19.43 | 43.48,19.43 43.48,23.98 | R25.2 43.48,19.43 | C20.1 41.13,36.47 38.68,36.47 37.26,35.05 37.26,30.68 38.73,29.21 41.38,29.21 43.48,27.11 43.48,23.98 | 45.02,28.64 C18.1
  Top 0.406: U5.8 57.6,17.72 58.11,18.24 v59.51,18.24 | 25.13,17.84 C33.1 | 25.76,18.32 C33.1 | R20.1 20.8,13.49 20.96,13.34 | 22.23,13.34 22.96,14.07 R29.1 24.13,16.8 24.13,17.14 25.3,18.32 C33.1 | 25.43,18.32 C33.1 | 27.14,20.09 v27.31,20.09 | INA219.4 11.13,23.56 v11.12,23.55 | C24.1 7.44,25.07 v8.1,25.73 | v43.48,17.53 43.48,27.11 45.02,28.64
  Top 0.508: PCA9533.8 v17.15,24.13 | 11.13,23.48 11.13,23.56
  Top 0.61: 40.06,8.2 41.27,6.99 v56.52,6.99 | v27.31,20.09 25.54,18.32 C33.1
  Top 0.813: v11.12,23.55 12.62,22.05 14.22,22.05 v18.82,17.45 18.82,14.83 20.32,13.34 20.96,13.34 22.23,13.34 23.5,12.07 3.3V_CONF.2 | 28.58,10.8 v29.85,10.8
  Top 1.016: C23.1 C24.1 | 3.3V_CONF.2 23.5,12.29 24.54,13.34 26.67,13.34 28.58,11.43 28.58,10.8 C13.1
  Bottom 0.406: v27.31,20.09 28.58,21.36 28.58,24.77 v29.21,25.4 | v8.1,25.73 10.82,25.73 11.12,26.04
  Bottom 0.508: v17.15,24.13 17.15,21.79 18.82,20.12 v18.82,17.45 | v11.12,23.55 11.15,23.57
  Bottom 0.61: v59.51,18.24 59.51,9.98 v56.52,6.99
  Bottom 0.813: 41.6,11.12 43.48,13 v43.48,17.53 | 3.3V.TP 15.37,32.38 11.12,28.14 11.12,26.04 v11.12,23.55 | 36.17,11.12 34.09,9.04 31.06,9.04 29.85,10.26 v29.85,10.8
  pour Top (isolate 0.406, rank 2, no thermals): 21.59,5.71 19.05,3.17 19.05,2.54 16.51,0 29.85,0 29.85,3.17 27.94,3.17 25.4,5.71
+5V  (via drill 0.35)
  Top 0.406: 18.47,41.61 RPI_ZERO.40 19.74,40.44 | C34.+ 20.98,36.96 19.74,38.2 19.74,40.44 | RPI_ZERO.38 19.74,40.44
  Top 0.61: R_L293DD.20 56.52,20.17 57.02,20.67 C9.1 C4.1
  Top 0.813: 75.23,20.32 75.08,20.17 L_L293DD.20 70.66,20.17 69.85,20.98 69.85,23.37 | 69.85,23.37 C5.1 | 69.85,23.37 C2.1 | C11.1 75.23,21.8 75.23,21.25
  Top 1.016: I2C.4 63.5,33.02 64.77,31.75 78.49,31.75 79.43,30.81 79.43,23.37 arc-90 78.16,22.1 77.48,22.1 arc90 LDIAR.P5 | 75.23,7.42 75.23,2.84 73.91,1.52 35.94,1.52 34.06,3.4 34.06,10.77 5V_CONV.OUT+ | 75.23,7.42 75.23,20.32 75.23,21.25 76.01,22.04 LDIAR.P5 | 76.71,22.1 77.36,22.1 LDIAR.P5 | Q9.3 75.25,7.44 75.23,7.42 | LDIAR.P5 76.7,22.04 | 76.65,22.04 LDIAR.P5 | v55.22,22.71 55.7,22.23 C9.1
  Bottom 1.016: v55.22,22.71 55.89,22.04 LDIAR.P5
  Bottom 1.778: 21.08,41.78 RPI_ZERO.38 RPI_ZERO.40 15.04,41.71 10.16,36.83 10.16,33.02 5.91,28.77 RGB_LED.P1 4.49,26.9 10.16,21.23 14.67,21.23 17.15,18.76 17.15,16.59 20.78,12.95 5V_CONV.OUT+
+8V  (via drill 0.5 pad 1.3)
  Top 0.406: INA219.2 9.83,22.58 12.17,20.25 14.69,20.25 16.28,18.65 16.28,15.88 15.01,14.61 13.33,14.61 12.06,13.34 12.06,12.07 13.78,10.35 | R17.1 13.78,10.35 | 13.78,10.35 5V_CONV.IN+
  Top 0.61: C3.+ 41.27,13.34 43.03,11.58 43.03,8.74
  Top 0.813: LIDAR_MOTOR.P1 77.34,41 C10.+ 73.34,40.84 D1.C
  Top 1.016: C43.+ 10.73,37.11 9.53,38.31 D3.C 8.58,39.56 FAN.P1 | 59.71,3.2 C12.+ | v57.63,3.61 59.64,3.61 C12.+ | R_L293DD.10 43.03,8.74 v42.54,8.25 | L_L293DD.10 61.44,8.74 60.96,8.25 60.96,4.92 C12.+ | 5V_CONV.IN+ 18.57,10.77 | 18.57,10.77 3.3V_CONF.3 | C15.1 18.57,9.17 18.57,10.77
  Bottom 1.778: LIDAR_MOTOR.P1 74.49,41.08 71.77,43.8 11.86,43.8 7.62,39.56 FAN.P1 3.37,39.56 1.91,38.1 1.91,22.86 5.08,19.69 7.62,19.69 9.53,17.78 9.53,15.24 11.81,12.95 5V_CONV.IN+ | v57.63,3.61 55.93,1.91 44.7,1.91 43.81,2.79 43.81,4.64 41.85,6.6 40,6.6 40,6.99 41.27,6.99 v42.54,8.25
  Bottom 2.54: 5V_CONV.IN+ 22.35,6.99 40,6.99
  pour Top (isolate 0.406, rank 2, no thermals): 11.3,10.11 15.42,13.74 17.2,11.96 14.27,8.56
BAT_LVL  (via drill 0.35)
  Top 0.305: STM32F103CB.10 29.64,19.59 29.92,19.3 29.92,18.29 29.41,17.78 v28.35,17.78
  Top 0.406: v17.4,28.96 17.02,29.34 7.87,29.34 5.84,27.3 5.08,27.3 4.15,26.38 4.15,24.89
  Top 0.61: R34.1 4.15,24.89 R35.2
  Bottom 0.406: v28.35,17.78 27.08,16.51 26.04,16.51 24.69,17.86 24.69,19.2 23.64,20.24 22.07,20.24 19.69,22.63 19.69,23.5 17.4,25.78 v17.4,28.96
FRONT_LIGHT  (via drill 0.35)
  Top 0.305: v39.73,18.14 39.73,18.69 38.83,19.59 STM32F103CB.27
  Top 0.61: R18.1 77.51,3.59 v76.18,2.26
  Bottom 0.406: v39.73,18.14 39.73,18.69 38.69,19.73 38.69,20.39 39.12,20.82 39.73,20.82 41.02,19.53 46,19.53 49.55,23.09 53.29,23.09 56.17,20.21 62.67,20.21 63.5,21.03 67.11,21.03 69.95,18.19 73.76,18.19 74.93,17.02 74.93,3.5 v76.18,2.26
GND  (via drill 0.35, 0.5 pad 1.3)  (2 unrouted)
  Top 0.254: MPU6050.18 49.05,30.68 49.33,30.4 50.47,30.4 50.98,30.91 53.77,30.91 C17.2 | MPU6050.1 49.05,39.06 RPI_ZERO.15 | MPU6050.9 39.88,33.5 | MPU6050.11 45.2,32.5 44.17,31.47 44.17,30.91 43.56,30.3 38.91,30.3 38.25,30.96 v38.25,34.14
  Top 0.305: 30.82,22.86 STM32F103CB.47 30.82,27.11 31.19,27.48 31.19,30.11 C40.2 | STM32F103CB.23 35.32,19.92 32.38,22.86 30.82,22.86 | STM32F103CB.8 30.11,20.59 30.82,21.3 30.82,22.86 | STM32F103CB.35 36.66,23.59 36.47,23.78 36.47,24.36 36.67,24.56 38,24.56 v38.46,25.02 | 49.05,30.68 48.45,30.07 47.47,30.07 46.35,28.96 46.35,27.17 C18.2 | C21.2 39.88,33.5 C20.2 38.51,34.92 38.25,34.67 v38.25,34.14 | R30.2 27.71,31.53 28.62,32.44
  Top 0.406: INA219.8 9.19,27.01 9.53,26.67 | 9.53,26.67 9.83,26.98 INA219.7 | 7.56,27.24 v7.62,27.3 | 59.55,6.7 U5.4 59.55,14.46 59.69,14.61 60.53,14.61 | 9.53,26.67 9.2,26.34 8.59,26.34 v7.62,27.3 | 9.53,26.67 9.88,26.31 10.39,26.31 10.48,26.22 INA219.3 | 7.62,27.13 v7.62,27.3 | R30.2 27.84,28.04 | 28.2,32.79 28.63,32.45 C40.2 | C17.2 55.25,32.38 56.52,32.38 | 56.52,32.38 59.05,32.38 | 59.05,32.38 59.69,32.38 60.96,33.66 I2C.3 | 56.52,32.38 56.52,30.48 53.34,27.3 48.89,27.3 | 48.89,27.3 48.68,27.09 R8.1 R14.1 | 48.89,27.3 48.68,27.52 R12.1 | 30.4,13.34 30.4,14.12 30.68,14.4 34.36,14.4 C39.2 | 30.4,13.34 30.4,11.86 v31.88,10.39 | C33.2 26.29,14.61 27.94,14.61 29.21,13.34 30.4,13.34 | 65.62,27.3 62.84,27.3 62.28,27.86 62.28,28.93 61.26,29.94 60.86,29.94 59.05,31.75 59.05,32.38 | 65.62,27.3 R10.1 R4.1 | 65.62,27.3 R7.1 | v38.46,25.02 38.46,26.39 38.86,26.8 C38.2
  Top 0.508: RPI_ZERO.1 65.46,40.44 60.38,40.44 RPI_ZERO.8 57.84,40.44 55.3,40.44 RPI_ZERO.12 52.76,40.44 50.22,40.44 RPI_ZERO.15 47.68,40.44 42.6,40.44 RPI_ZERO.22 | RPI_ZERO.28 32.44,40.44 29.9,40.44 RPI_ZERO.31 27.33,40.46 24.79,40.46 RPI_ZERO.36 | C36.1 19.38,22.91 19.38,30.81 20.98,32.41 C34.- | IRLML2502.2 13.97,39.37 15.19,38.15 C43.- 15.19,36.15 13.35,34.3 PCA9533.4 13.35,34.28 | 59.55,6.7 C12.- | 7.81,26.99 7.56,27.24
  Top 0.61: L_L293DD.17 L_L293DD.4 60.68,16.36 60.53,16.51 | L_L293DD.16 L_L293DD.5 60.68,15.09 60.53,15.24 | L_L293DD.15 L_L293DD.6 60.68,13.82 60.53,13.97 | L_L293DD.14 L_L293DD.7 60.6,12.55 60.53,12.62 60.53,13.97 | v12.7,34.92 13.32,34.3 13.35,34.3 | 60.53,13.97 60.53,14.61 60.53,15.24 | 60.53,15.24 60.53,16.51 | 56.52,15.24 56.52,13.97 | 56.52,13.97 56.52,12.7 56.36,12.55 R_L293DD.14 R_L293DD.7 43.97,12.55 43.59,12.93 43.59,13.97 | 56.52,15.24 56.36,15.09 R_L293DD.16 R_L293DD.5 43.74,15.09 43.59,15.24 | 56.52,13.97 56.36,13.82 R_L293DD.15 R_L293DD.6 43.74,13.82 43.59,13.97 | 56.52,15.24 60.53,15.24 | 43.59,13.97 43.59,15.24 | 43.59,15.24 42.16,16.66 C3.- | 43.59,15.24 43.59,16.21 43.74,16.36 R_L293DD.4 R_L293DD.17 56.52,16.36 | 56.52,16.36 56.57,16.41 56.57,18.47 57.17,19.07 59.86,19.07 | 56.52,16.36 56.52,15.24 | IRLML1.2 68.22,33.02 65.79,33.02 65.18,33.63 65.18,37.62 RPI_ZERO.1 | C4.2 C9.2 59.82,19.11 59.86,19.07 | 59.86,19.07 60.53,18.4 60.53,16.51
  Top 0.813: C37.1 23.65,35.46 C34.- 19.3,34.47 v19.3,35.56 | 4.59,22.66 C24.2 | 5.75,10.84 5.75,8.93 5.08,8.25 C27.- 5.1,6.48 C16.2 | C37.1 28.63,38.64 RPI_ZERO.31 | C40.2 28.62,32.44 27.87,33.04 C37.1 | C2.2 70.97,26.8 | C2.2 C5.2 68.58,29.44 67.54,30.48 63.5,30.48 60.96,33.02 I2C.3 | C2.2 C11.2
  Top 1.016: RPI_ZERO.1 68.5,39.17 C10.- | C23.2 C24.2 5.88,23.94 R35.1 5.88,25.56 v7.62,27.3 | 5V_CONV.IN- 18.42,5.59 C15.2 | 31.88,6.35 31.75,6.22 C13.2 26.44,6.22 25.8,6.87 3.3V_CONF.1 | v39.45,16.18 39.78,16.51 41.27,16.51 C3.-
  Top 1.27: 5V_CONV.IN- 16.51,3.68 | C23.2 4.59,20.17 6.35,18.41 7.26,18.41 8.26,17.42 8.26,13.34 5.75,10.84 PWR.2
  Top 1.778: 5V_CONV.OUT- 31.88,6.35 v31.88,10.39
  Bottom 0.305: 32.35,4.02 5V_CONV.OUT- | v38.25,34.14 42.54,38.43 42.54,40.49 RPI_ZERO.22
  Bottom 0.61: v38.46,25.02 38.48,25.02 39.37,24.13 | GND.TP 22.23,33.66 20.32,33.66 19.3,34.67 v19.3,35.56 | v12.7,34.92 13.97,33.66 | I2C.3 60.96,36.42 62.15,37.62 65.18,37.62 RPI_ZERO.1
  Bottom 0.813: 73.03,31.12 73.16,31.25 78.58,31.25 79.53,30.3 79.53,24.13 | FRONTLIGHT.P2 78.45,12.41 79.53,13.49 79.53,24.13 | 79.53,24.13 79.43,24.04 LDIAR.P4
  Bottom 1.016: v39.45,16.18 36.83,16.18 36.5,16.51
  Bottom 1.27: v31.88,10.39 33.25,10.39 34.92,12.07 34.92,13.97 36.5,15.55 36.5,16.51 36.5,21.26 39.37,24.13 46.22,24.13 48.13,26.04 68.38,26.04 73.03,30.68 73.03,31.12 73.03,34.29 68.15,39.17 RPI_ZERO.1 | v7.62,27.3 13.97,33.66 15.88,35.56 v19.3,35.56
  Bottom 2.54: 5V_CONV.OUT- 5V_CONV.IN- 13.06,3.56 5.78,10.84 PWR.2
  pour Top (rank 3): -1.27,46.36 -1.27,-0.64 81.92,-0.64 81.92,46.36
  pour Bottom (rank 3): -2.54,-1.27 -2.54,47.62 83.19,47.62 83.19,-1.91 -2.54,-1.91
  cutout Top (rank 3): 45.09,36.2 45.09,30.48 50.8,30.48 50.8,36.2
LIDAR_POS_INT  (via drill 0.35)
  Top 0.305: STM32F103CB.25 38.44,18.59 38.61,18.41 38.61,17.53 v38.58,17.5
  Bottom 0.406: v38.58,17.5 38.58,18.8 38.02,19.36 38.02,20.73 38.76,21.46 40.06,21.46 41.3,20.22 45.64,20.22 49.17,23.75 69.47,23.75 71.76,26.04 LDIAR.P3
M_DIR_L_1  (via drill 0.35)
  Top 0.305: 66.85,18.9 66.85,20.14 64.77,22.23 64.77,25.19 R10.2 | STM32F103CB.39 34.82,23.59 v34.8,23.57
  Top 0.406: 63.92,26.25 R10.2 62.86,26.04 61.69,27.21 61.69,28.48 v60.96,29.21
  Top 0.61: L_L293DD.19 66.85,18.9 | 66.85,18.9 L_L293DD.2 | 66.89,18.94 66.85,18.9
  Bottom 0.406: v34.8,23.57 35.64,24.41 35.64,25 37.61,26.98 46.09,26.98 47.26,28.14 59.89,28.14 v60.96,29.21
M_DIR_L_2  (via drill 0.35)
  Top 0.305: STM32F103CB.38 35.32,26.96 v34.75,27.53
  Top 0.406: v60.96,31.12 62.13,29.95 62.55,29.95 R7.2 64.99,29.64 66.37,29.64 66.85,29.16 66.85,22.68 67.11,22.43 67.31,22.23 v68.58,20.96
  Top 0.61: L_L293DD.9 69.85,10.01 L_L293DD.12 73.36,10.01 73.89,10.54 v73.89,19.13
  Bottom 0.406: v73.89,19.13 70.41,19.13 v68.58,20.96 | v34.75,27.53 45.86,27.53 47.02,28.7 58.55,28.7 v60.96,31.12
M_DIR_R_1  (via drill 0.35)
  Top 0.305: STM32F103CB.14 30.82,19.72 v30.84,19.74
  Top 0.406: 52.7,18.9 52.7,21.17 R14.2 51.65,24.77 53.34,24.77 v59.05,30.48
  Top 0.61: R_L293DD.2 52.7,18.9 R_L293DD.19
  Bottom 0.406: v30.84,19.74 31.17,20.07 31.12,20.12 31.12,22.86 32.59,24.33 32.59,28.14 33.83,29.39 45.34,29.39 46.33,30.38 54.11,30.38 54.94,31.21 58.32,31.21 v59.05,30.48
M_DIR_R_2  (via drill 0.35)
  Top 0.305: v31.9,21.39 31.93,21.36 31.93,19.41 31.32,18.8 STM32F103CB.15
  Top 0.406: v55.24,30.48 53.34,28.58 R12.2 49.39,29.57 48.01,29.57 46.99,28.55 46.99,22.86 48.69,21.16 v49.78,21.16
  Top 0.61: R_L293DD.9 R_L293DD.12 v56.59,10.01
  Bottom 0.406: v56.59,10.01 53.34,13.26 53.34,20.32 52.5,21.16 v49.78,21.16 | v31.9,21.39 31.9,22.86 33.15,24.1 33.15,27.91 34.05,28.81 | 34.05,28.81 34.06,28.83 | 34.05,28.81 34.2,28.81 34.21,28.83 45.57,28.83 46.56,29.82 54.59,29.82 v55.24,30.48
N$1  (via drill 0.35)
  Top 0.813: R_L293DD.8 v47.55,11.28
  Bottom 0.813: v47.55,11.28 47.55,8.41 46.06,6.92 MOTOR_R_B.P2
N$2  (via drill 0.35)
  Top 0.813: R_L293DD.18 v50.01,17.63
  Bottom 0.813: v50.01,17.63 50.01,7.77 51.43,6.35 52.7,6.35 53.05,6 MOTOR_R_F.P2
N$3  (via drill 0.35)
  Top 0.813: R_L293DD.13 v51.33,11.28
  Bottom 0.813: v51.33,11.28 51.33,8.1 51.89,7.54 54.05,7.54 55.05,6.54 MOTOR_R_F.P1
N$4  (via drill 0.35)
  Top 0.813: L_L293DD.18 v68.78,17.63
  Bottom 0.813: v68.78,17.63 68.78,9.32 71.47,6.64 MOTOR_L_F.P2
N$5  (1 unrouted)
N$16  (via drill 0.35)
  Top 0.813: L_L293DD.13 v69.8,11.28
  Bottom 0.813: MOTOR_L_F.P1 73.47,6.54 69.8,10.21 v69.8,11.28
N$17  (via drill 0.35)
  Top 0.813: L_L293DD.8 v66.27,11.28
  Bottom 0.813: v66.27,11.28 66.27,8.48 64.48,6.69 MOTOR_L_B.P2
N$18  (via drill 0.35)
  Top 0.61: 67.54,17.63 v67.56,17.65
  Top 0.813: L_L293DD.3 67.54,17.63
  Bottom 0.813: v67.56,17.65 67.56,7.87 66.48,6.79 MOTOR_L_B.P1
N$19
  Top 0.61: Q9.1 78.7,4.17 R18.2
N$20
  Top 0.61: Q9.2 79.63,9.32 79.63,17.14 78.64,18.14 R3.1
N$21
  Top 0.61: FRONTLIGHT.P1 77.42,15.92 76.75,16.6 R3.2
N$22
  Top 0.406: PCA9533.3 14.62,31.63 14.38,31.39 12.93,31.39 11.94,32.38 11.94,33.36 R26.1
  Top 0.508: 10.38,34.73 R26.1
N$23
  Top 0.406: R27.1 10.49,32.72 12.47,30.73 15.09,30.73 15.88,31.53 PCA9533.2
N$24
  Top 0.406: R28.1 10.73,30.12 16.15,30.12 17.15,31.12 PCA9533.1
  Top 0.508: 10.59,30.48 R28.1
N$26  (via drill 0.35)
  Top 0.813: R_L293DD.3 v48.74,17.63
  Bottom 0.813: MOTOR_R_B.P1 48.06,7.12 48.74,7.8 v48.74,17.63
N$31
  Top 0.406: RGB_LED.P4 8.52,34.77 R26.2
N$33
  Top 0.406: RGB_LED.P3 8.62,32.77 R27.2
  Top 0.508: 8.54,32.84 R27.2
N$34
  Top 0.305: MPU6050.20 52.03,32.5 C17.1
N$35
  Top 0.406: RGB_LED.P2 6.06,30.77 6.35,30.48 R28.2
N$36
  Top 0.254: C21.1 43.81,31.75 45.06,33 MPU6050.10
N$37
  Top 0.508: IRLML2502.3 13.06,41.4 14.95,41.4 R22.2
N$38
  Top 0.813: R38.2 69.15,35.88 IRLML1.3
N$39
  Top 0.813: LIDAR_MOTOR.P2 77.44,39.06 D1.A 75.61,33.02 72.39,33.02 71.2,34.21 IRLML1.1
N$46
  Top 0.305: STM32F103CB.6 24.06,21.59
  Top 0.406: C36.2 24.06,21.59
  Top 0.508: KX-9A.1 23.96,21.13 C36.2
N$47
  Top 0.305: 24.93,32.55 C37.2 25.45,32.38 25.45,31.06 26.39,30.12 26.39,23.14 27.44,22.09 STM32F103CB.5
  Top 0.508: KX-9A.3 21.76,30.65 23.5,32.38 25.45,32.38
N$49
  Top 0.305: STM32F103CB.2 27.57,23.59 27.1,24.05 27.1,25.9 R30.1
N$55
  Top 1.016: IRLML2502.1 9.58,42.42 D3.A 9.53,42.36 8.73,41.56 FAN.P2
NRST  (via drill 0.35)  (2 unrouted)
  Top 0.305: STM32F103CB.7 26.62,21.09 v26.24,20.7
  Bottom 0.305: RPI_ZERO.26 34.9,40.36 34.9,38.3 34.06,37.47 29.85,37.47 27.94,35.56 27.94,22.4 v26.24,20.7
PWM_FAN  (via drill 0.35)
  Top 0.305: STM32F103CB.18 v32.82,15.19
  Top 0.406: v18.42,23.5 18.42,32.44 17.93,32.92 17.93,36.88 15.65,39.17 R22.1
  Bottom 0.406: v32.82,15.19 arc-90 32.03,14.4 23.7,14.4 19.69,18.41 19.69,20.96 18.42,22.23 v18.42,23.5
PWM_LIDAR  (via drill 0.35)
  Top 0.305: STM32F103CB.19 33.32,18.08 33.66,18.41 v34.29,18.41
  Top 0.406: 67.22,34.29 R38.1
  Top 0.61: R38.1 v66.15,34.18 v66.14,34.19
  Bottom 0.406: v34.29,18.41 35.51,19.63 35.51,21.67 36.85,23.02 36.85,24.64 38.03,25.81 46.5,25.81 47.72,27.03 62.59,27.03 66.14,30.58 v66.14,34.19
PWM_M_EN_L  (via drill 0.35)
  Top 0.305: STM32F103CB.16 31.82,15.77 v31.3,15.24
  Top 0.406: 61.59,20.14 61.62,20.12 61.67,20.17 L_L293DD.1 | v60.96,27.94 60.96,26.45 R4.2 63.17,22.75 63.17,20.17
  Top 0.61: L_L293DD.1 63.17,20.17 v64.77,20.17 | L_L293DD.11 v64.77,8.74
  Bottom 0.406: v31.3,15.24 33.38,17.32 33.38,18.59 34.95,20.17 34.95,21.9 36.2,23.15 36.2,24.77 37.79,26.37 46.27,26.37 47.49,27.58 60.6,27.58 v60.96,27.94
  Bottom 0.61: v64.77,20.17 v64.77,8.74
PWM_M_EN_R  (via drill 0.35)
  Top 0.305: STM32F103CB.17 32.32,18.35 32.84,18.87 v32.84,19.76 | R8.2 50.38,24.98 49.53,24.13 49.53,22.86 51.33,21.06 v51.33,20.17
  Top 0.406: 46.04,20.18 46.05,20.17 | v57.78,30.48 53.34,26.04 R8.2
  Top 0.61: R_L293DD.1 46.05,20.17 v51.33,20.17 | R_L293DD.11 v52.43,8.74
  Bottom 0.406: v32.84,19.76 32.84,23.01 33.71,23.87 33.71,27.53 34.44,28.27 | 34.44,28.27 34.45,28.27 | 34.44,28.27 45.8,28.27 46.79,29.26 56.57,29.26 v57.78,30.48
  Bottom 0.61: v51.33,20.17 52.43,19.07 v52.43,8.74
SCL  (via drill 0.35)
  Top 0.305: STM32F103CB.42 33.32,27.26 32.71,27.86 32.71,29.41 33.68,30.38 v34.9,30.38 34.9,31.14 33.66,32.38 v32.38,32.38 | MPU6050.23 50.84,34 51.97,35.13 v51.97,36.73 | 20.1,16.48 22.11,16.48 R29.2
  Top 0.406: INA219.5 11.13,26.97 11.73,26.37 11.73,24.18 13,22.91 14.83,22.91 19.69,18.06 19.69,16.9 20.1,16.48 | v22.96,18.9 R29.2 | v51.97,36.73 52.81,36.73 53.34,36.2 53.34,34.92 54.61,33.66 57.15,33.66 | 57.15,33.66 57.12,33.68 | I2C.2 58.42,34.92 57.15,33.66
  Top 0.508: v22.96,18.9 22.43,19.43 20.42,19.43 14.61,25.25 PCA9533.6
  Bottom 0.406: 23.01,18.9 v22.96,18.9 22.96,17.68 25.4,15.24 27.94,15.24 29.85,17.14 29.85,22.86 31.75,24.77 31.75,28.58 34.29,31.12 | v34.9,30.38 34.29,30.99 34.29,31.12 | v32.38,32.38 SCL.TP | v51.97,36.73 43.71,36.73 39.37,32.38 35.56,32.38 34.29,31.12
SDA  (via drill 0.35)
  Top 0.305: MPU6050.24 50.37,34.5 51,35.13 v51,37.49 | STM32F103CB.43 32.82,27.07 31.95,27.94 v31.95,30.96
  Top 0.406: R20.2 v20.8,18.57 20.07,18.57 15.14,23.5 13.33,23.5 12.37,24.46 12.37,28.32 | PCA9533.7 15.88,28.04 15.6,28.32 12.37,28.32 | 12.37,28.32 11.99,28.7 10.77,28.7 10.48,28.42 INA219.6 | v51,37.49 55.22,37.49 55.88,36.83 I2C.1
  Bottom 0.406: v20.8,18.57 21.92,19.69 23.41,19.69 24.13,18.97 24.13,17.53 25.78,15.88 27.61,15.88 29.26,17.53 29.26,23.07 31.19,25 31.19,28.81 32.62,30.24 | 35.56,33.17 35.56,34.92 35.51,34.98 33.38,34.98 32.79,35.56 SDA.TP | 32.62,30.24 35.56,33.17 | v31.95,30.96 32.62,30.29 32.62,30.24 | v51,37.49 43.36,37.49 39.04,33.17 35.56,33.17
SWCLK
  Top 0.305: STM32F103CB.37 35.82,27.3 35.82,27.4 35.82,35.82 37.46,37.47 37.46,42.14 38.51,43.18 42.39,43.18 RPI_ZERO.20
SWDIO
  Top 0.305: RPI_ZERO.24 40.08,40.41 40.08,38.18 39.37,37.47 38.73,37.47 36.58,35.31 36.58,27.53 36.58,27.3 36.58,25.21 35.94,24.57 35.94,23.55 36.4,23.09 STM32F103CB.34
TEMPERATURE  (via drill 0.35)
  Top 0.305: STM32F103CB.28 v39.41,20.09 | v39.41,20.09 v39.42,20.09 | R25.1 40.02,20.09 v39.41,20.09
  Top 0.406: U5.1 57.6,10.78 v57.61,10.77
  Bottom 0.406: v39.42,20.09 40.77,18.75 46.2,18.75 49.84,22.38 52.93,22.38 57.61,17.7 v57.61,10.77
U1_RX  (via drill 0.35)
  Top 0.305: STM32F103CB.31 40,21.59 v40.64,22.23
  Bottom 0.406: LDIAR.P1 73.95,30.04 68.96,25.04 48.54,25.04 45.72,22.23 v40.64,22.23
U1_TX  (via drill 0.35)
  Top 0.305: STM32F103CB.30 41.94,21.09 v41.96,21.11
  Bottom 0.406: LDIAR.P2 72.87,28.04 69.22,24.38 48.87,24.38 45.59,21.11 v41.96,21.11
USART2_RX  (via drill 0.35)
  Top 0.305: STM32F103CB.13 30.32,15.84 30.12,15.65 29.06,15.65 v27.03,17.65
  Bottom 0.305: RPI_ZERO.34 26.09,41.33 24.77,40.01 24.77,38.73 26.67,36.83 26.67,23.72 24.74,21.79 24.74,19.96 v27.03,17.65
USART2_TX  (via drill 0.35)
  Top 0.305: STM32F103CB.12 v27.24,18.59 v27.23,18.59
  Bottom 0.305: RPI_ZERO.32 27.33,40.41 27.33,23.51 25.4,21.58 25.4,20.32 27.13,18.59 v27.23,18.59
V+
  Top 0.406: INA219.1 9.19,20.03 10.49,18.72 10.49,3.68 | PWR.1 2.54,12.66 2.54,4.44 3.33,3.66 C27.+ 5.1,3.68 C16.1 10.49,3.68 | 10.49,3.68 R17.2
  Top 0.61: R34.2 2.49,19.05 2.5,19.05 PWR.1
  pour Top (isolate 0.406, rank 2, no thermals): 5.08,16.51 3.56,14.99 arc45 1.35,8.3 1.5,5.49 arc45 2.57,3.45 arc49 4.61,2.63 11.05,2.92 11.1,4.42 6.48,4.5 arc-17 4.54,4.84 arc-71 3.8,5.85 3.75,9.49 arc-42 5.56,14.41 6.38,15.34
(copper drawn outside any net)
  shapes: Top area x4

### Text on the board
Unrouted: TODO: am untersten rechten (pin24) 3.3v vom stm32 fehlt der kondensator | TODO: heatsink thermal for +3v3
tNames: + | - + | -
bNames: 5v GND SDA SCL | ζ2 Motherboard